# Altium project dv_power.PrjPcb
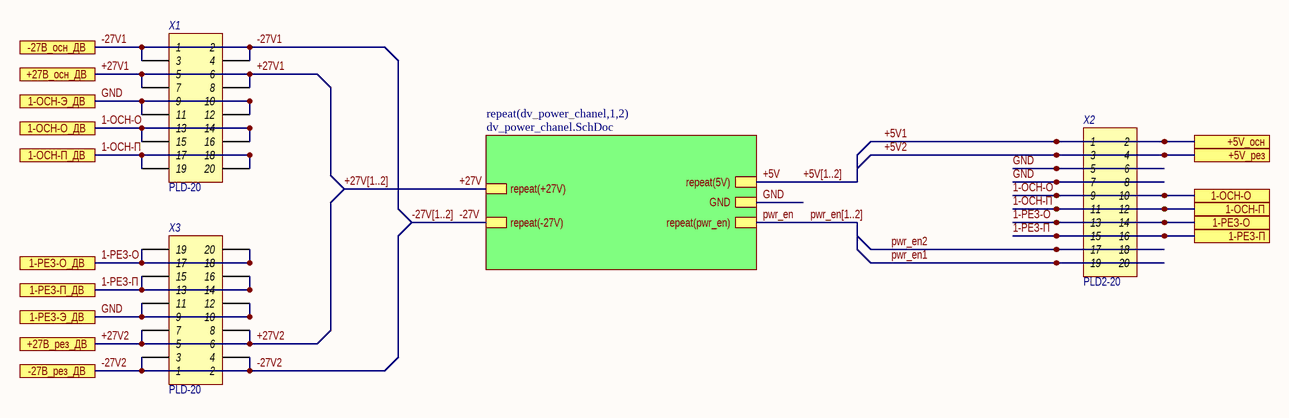
[diagram p0: dv_power.SchDoc]
GlobalOrganizationName: НГУ; GlobalProjectName1: Схема электрическая; GlobalProjectName2: принципиальная.; GlobalProjectName3: Модуль питания; GlobalProjectNumber: ЮМП.250.270.042.01 Э3; GlobalProjectRevision: #1.0; Норм.Контр.: Задорожная; Проверил: Стюф; Разработал: Пелемешко; Т.Контр.: Селезнев; Утвердил: Прокопьев
2 sheets, 25 parts. Net scope: hierarchical (ports join the sheet entries above them; power ports are global).
Board file: dv_power.PcbDoc
Sheets:
  dv_power.SchDoc
    dv_power_chanel1 = dv_power_chanel.SchDoc
    dv_power_chanel2 = dv_power_chanel.SchDoc

## Sheet dv_power.SchDoc: =GlobalProjectName
size 410 x 297 mm; ApprovedBy: Прокопьев; CheckedBy: Стюф; Author: Пелемешко; Organization: НГУ; DocumentNumber: ЮМП.250.270.042.01 Э3 Э3; Revision: #1.0; SheetNumber: 1; SheetTotal: 2; PageSetup: Record=PageOptions|CenterHorizontal=True|CenterVertical=True|PrintScale=1.00|XCorrection=1.00|YCorrection=1.00|PrintKind=1|BorderSize=5000000|LeftOffset=0|BottomOffset=0|Orientation=2|PaperLength=1000|PaperWidth=1000|Scale=100|PaperSource=15|PrintQuality=1200|MediaType=1|DitherType=10|PaperKind=A3|PrintScaleMode=1; Weight: -; ScaleFactor: -; NormInspection: Задорожная; FirstApplication: ЮМП.250.270.042.01 Э3

### Parts
X1  Наименование: PLD-20  [PBD-20]  (hidden comment: Header 2X20)
X2  Наименование: PLD2-20  [SD87340-20]  (hidden comment: Header 2X20)
X3  Наименование: PLD-20  [PBD-20]  (hidden comment: Header 2X20)

### Sub-sheets
repeat(dv_power_chanel,1,2) = dv_power_chanel.SchDoc: repeat(-27V), GND, repeat(5V), repeat(pwr_en), repeat(+27V)

### Ports
1-ОСН-О, 1-ОСН-О_ДВ, 1-ОСН-П, 1-ОСН-П_ДВ, 1-ОСН-Э_ДВ, 1-РЕЗ-О, 1-РЕЗ-О_ДВ, 1-РЕЗ-П, 1-РЕЗ-П_ДВ, 1-РЕЗ-Э_ДВ, +5V_осн, +5V_рез, +27В_осн_ДВ, +27В_рез_ДВ, -27В_осн_ДВ, -27В_рез_ДВ

### Nets
GND: X1.9 X1.10 X1.11 X1.12 X2.5 X2.6 X2.7 X2.8 X3.9 X3.10 X3.11 X3.12 ; port 1-ОСН-Э_ДВ, port 1-РЕЗ-Э_ДВ, sheet repeat(dv_power_chanel,1,2)/GND
1-ОСН-О: X1.13 X1.14 X1.15 X1.16 X2.9 X2.10 ; port 1-ОСН-О, port 1-ОСН-О_ДВ
1-ОСН-П: X1.17 X1.18 X1.19 X1.20 X2.11 X2.12 ; port 1-ОСН-П, port 1-ОСН-П_ДВ
1-РЕЗ-О: X2.13 X2.14 X3.17 X3.18 X3.19 X3.20 ; port 1-РЕЗ-О, port 1-РЕЗ-О_ДВ
1-РЕЗ-П: X2.15 X2.16 X3.13 X3.14 X3.15 X3.16 ; port 1-РЕЗ-П, port 1-РЕЗ-П_ДВ
+5V: sheet repeat(dv_power_chanel,1,2)/repeat(5V)  [also labelled +5V[1..2]]
+5V1: X2.1 X2.2 ; port +5V_осн  [also labelled +5V[1..2]1]
+5V2: X2.3 X2.4 ; port +5V_рез  [also labelled +5V[1..2]2]
+27V: sheet repeat(dv_power_chanel,1,2)/repeat(+27V)
+27V1: X1.5 X1.6 X1.7 X1.8 ; port +27В_осн_ДВ
+27V2: X3.5 X3.6 X3.7 X3.8 ; port +27В_рез_ДВ
-27V: sheet repeat(dv_power_chanel,1,2)/repeat(-27V)
-27V1: X1.1 X1.2 X1.3 X1.4 ; port -27В_осн_ДВ
-27V2: X3.1 X3.2 X3.3 X3.4 ; port -27В_рез_ДВ
pwr_en: sheet repeat(dv_power_chanel,1,2)/repeat(pwr_en)
pwr_en1: X2.19 X2.20
pwr_en2: X2.17 X2.18

### Buses and harness runs
bus +27V[1..2]
bus -27V[1..2]
bus pwr_en[1..2]

### Notes on the sheet
- Перв. примен.
- Справ. №
- Подп. и дата
- Инв. № дубл.
- Взам. инв. №
- Изм.
- Разраб.
- Лист
- № докум.
- Подп.
- Дата
- Литера
- Масса
- Масштаб
- Пров.
- Т.контр.
- Листов
- Н.контр.
- Утв.
- Инв. № подл.
- Форма 1 ГОСТ 2.104-2006
- Копировал
- Формат А3

### Library data of the parts
X1-X3 = Header 2X20: Header, 20-Pin, Dual row; Потребление, Вт: 0,0; Назначение: Header, 20-Pin, Dual row

## Sheet dv_power_chanel.SchDoc: =GlobalProjectName
size 209 x 297 mm; ApprovedBy: Утвердил; CheckedBy: Проверил; Author: Разработал; Organization: НГУ; DocumentNumber: ЮМП.250.270.042.01 Э3 Э3; Revision: #1.0; SheetNumber: 2; SheetTotal: 2; PageSetup: Record=PageOptions|CenterHorizontal=True|CenterVertical=True|PrintScale=1.00|XCorrection=1.00|YCorrection=1.00|PrintKind=1|BorderSize=5000000|LeftOffset=0|BottomOffset=0|Orientation=2|PaperLength=1000|PaperWidth=1000|Scale=100|PaperSource=15|PrintQuality=1200|MediaType=1|DitherType=10|PaperKind=A3|PrintScaleMode=1; Weight: -; ScaleFactor: -; NormInspection: Норм.Контр.; FirstApplication: ЮМП.250.270.042.01 Э3
Used 2 times, as channels dv_power_chanel1, dv_power_chanel2. Parts and nets are listed once, with the designators drawn on the sheet.
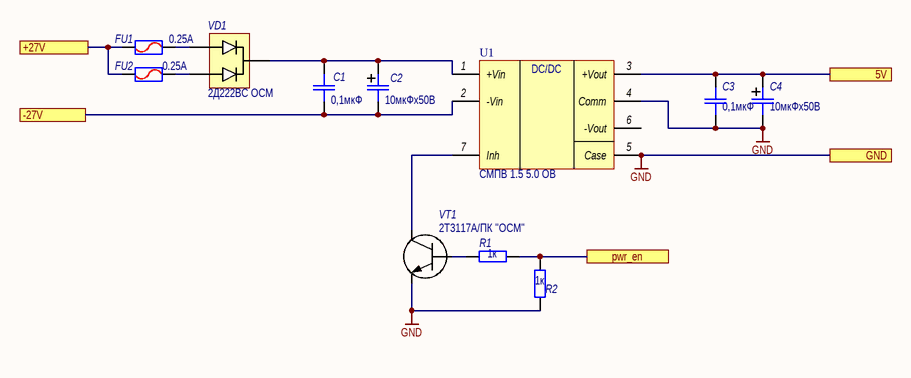
[diagram p1: dv_power_chanel.SchDoc]

### Parts
C1  value 0,1мкФ  [SMD_C0805]  (hidden comment: K10-79)
C2  value 10мкФх50В  [SMD_size_B]  (hidden comment: OS K53-68)
C3  value 0,1мкФ  [SMD_C0805]  (hidden comment: K10-79)
C4  value 10мкФх50В  [SMD_size_B]  (hidden comment: OS K53-68)
FU1  value 0.25A  [VP1-2]  (hidden comment: VP1-2)
FU2  value 0.25A  [VP1-2]  (hidden comment: VP1-2)
R1  value 1к  [SMD_0805]  (hidden comment: OSM R1-12)
R2  value 1к  [SMD_0805]  (hidden comment: OSM R1-12)
U1  Наименование: СМПВ 1.5 5.0 ОВ  [SLH28xx]  (hidden comment: SMPV 1.5 5.0 OV)
VD1  Наименование: 2Д222ВС ОСМ  [4116.4-3_offcut]  (hidden comment: 2D222VS "OSM")
VT1  Наименование: 2Т3117А/ПК "ОСМ"  [TO-18]  (hidden comment: 2T3117A)

### Ports
5V, +27V, -27V, GND, pwr_en

### Nets
GND: C3.1 C4.2 R2.1 U1.4(Comm) U1.5(Case) VT1.1(EMITTER) ; port GND
5V: C3.2 C4.1 U1.3(+Vout) ; port 5V
+27V: FU1.1 FU2.1 ; port +27V
-27V: C1.1 C2.2 U1.2(-Vin) ; port -27V
pwr_en: R1.2 R2.2 ; port pwr_en
NetC1_2: C1.2 C2.1 U1.1(+Vin) VD1.8
NetFU1_2: FU1.2 VD1.11
NetFU2_2: FU2.2 VD1.17
NetR1_1: R1.1 VT1.2(BASE)
NetU1_7: U1.7(Inh) VT1.3(COLLECTOR)

Not connected (* = marked no-connect by the designer): U1 6(-Vout)

### Channels
dv_power_chanel1: ports 5V=+5V1 +27V=+27V1 -27V=-27V1 GND=GND pwr_en=pwr_en1
dv_power_chanel2: designators C1=C5 C2=C6 C3=C7 C4=C8 FU1=FU3 FU2=FU4 R1=R3 R2=R4 U1=U2 VD1=VD2 VT1=VT2; ports 5V=+5V2 +27V=+27V2 -27V=-27V2 GND=GND pwr_en=pwr_en2

### Notes on the sheet
- Подп. и дата
- Инв. № дубл.
- Взам. инв. №
- Инв. № подл.
- Изм.
- Лист
- № докум.
- Подп.
- Дата
- Форма 2а ГОСТ 2.104-2006
- Копировал
- Формат А4
- (in symbol SLH28xx) DC/DC

### Library data of the parts
C1 C3 = Capacitor: Назначение: SMD-конденсатор; Наименование: К10-79; Потребление, Вт: 0; Напряжение: В; Точность: %
C2 C4 = Capacitor_pol: Polarized capacitor; Назначение: Поляризованный SMD-конденсатор; Наименование: ОС К53-68; Потребление, Вт: 0
FU1 FU2 = VP1-2: Предохранитель плавкий; Наименование: ВП1-2 "ВП"; Назначение: Предохранитель плавкий; ComponentLink1Description: DataSheet; ComponentLink1URL: https://docviewer.yandex.ru/view/20572601/?page=1&*=oYyHA%2BCwzeyRvrmOJV6%2ByaBlbHJ7InVybCI6Imh0dHBzOi8vZWwtcmEucnUvdXBsb2FkL2libG9jay8wMTYvdnN0YXZrYS1wbGF2a2EtdnAxXzItX2VsZWt0cm9uaWthX3JhXy5wZGYiLCJ0aXRsZSI6InZzdGF2a2EtcGxhdmthLXZwMV8yLV9lbGVrdHJvbmlrYV9yYV8ucGRmIiwibm9pZnJhbWUiOnRydWUsInVpZCI6IjIwNTcyNjAxIiwidHMiOjE1OTI0NzI0NTM1MTUsInl1IjoiODg5MDYxMzMxNTQzMzg3MTIxIiwic2VycFBhcmFtcyI6Imxhbmc9cnUmdG09MTU5MjQ3MjQyOCZ0bGQ9cnUmbmFtZT12c3RhdmthLXBsYXZrYS12cDFfMi1fZWxla3Ryb25pa2FfcmFfLnBkZiZ0ZXh0PSVEMCVCMiVEMCVCRjEtMiZ1cmw9aHR0cHMlM0EvL2VsLXJhLnJ1L3VwbG9hZC9pYmxvY2svMDE2L3ZzdGF2a2EtcGxhdmthLXZwMV8yLV9lbGVrdHJvbmlrYV9yYV8ucGRmJmxyPTY1Jm1pbWU9cGRmJmwxMG49cnUmc2lnbj0yZWMwNDRiZDQyMGRlMjRmMjI1MThkNTc4YjZlMTlkYiZrZXlubz0wIn0%3D&lang=ru
R1 R2 = Resistor: Наименование: ОСМ Р1-12; Назначение: SMD-резистор; Потребление, Вт: 0,001; Точность: %
U1 = SLH28xx: DC-DC; Назначение: DC-DC преобразователь; Потребление, Вт: 0.1; ComponentLink1Description: DataSheet; ComponentLink1URL: https://www.interpoint.com/product_documents/SLH_Space_DC_DC_Converters.pdf
VD1 = 2D222: Сдвоенный диод; Потребление, Вт: 0,004; Назначение: Сдвоенный диод; ComponentLink1Description: DataSheet; ComponentLink1URL: https://eandc.ru/pdf/diod/2d222.pdf
VT1 = 2T3117A: Кремниевый биполярный / эпитаксиально-планарный / n-p-n транзистор; Назначение: Биполярный транзистор; Потребление, Вт: 0,0; ComponentLink1Description: DataSheet; ComponentLink1URL: https://www.integral.by/sites/default/files/pdf/2t3117.pdf

## Nets that join several sheets
GND: dv_power (12 pins), dv_power_chanel1 (6 pins), dv_power_chanel2 (6 pins)
+5V1: dv_power (X2.1 X2.2), dv_power_chanel1 (C3.2 C4.1 U1.3)
+5V2: dv_power (X2.3 X2.4), dv_power_chanel2 (C7.2 C8.1 U2.3)
+27V1: dv_power (X1.5 X1.6 X1.7 X1.8), dv_power_chanel1 (FU1.1 FU2.1)
+27V2: dv_power (X3.5 X3.6 X3.7 X3.8), dv_power_chanel2 (FU3.1 FU4.1)
-27V1: dv_power (X1.1 X1.2 X1.3 X1.4), dv_power_chanel1 (C1.1 C2.2 U1.2)
-27V2: dv_power (X3.1 X3.2 X3.3 X3.4), dv_power_chanel2 (C5.1 C6.2 U2.2)
pwr_en1: dv_power (X2.19 X2.20), dv_power_chanel1 (R1.2 R2.2)
pwr_en2: dv_power (X2.17 X2.18), dv_power_chanel2 (R3.2 R4.2)